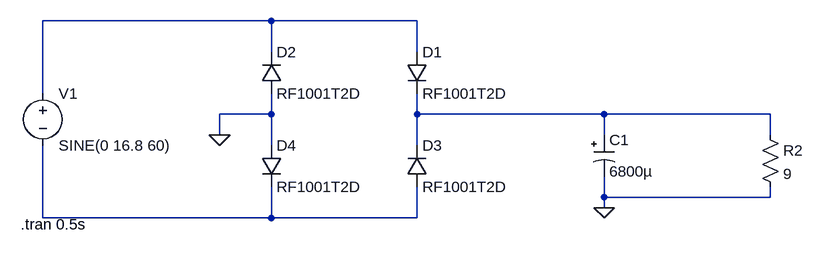
[diagram p0: schematic FulWaveBridge.asc]
FulWaveBridge.asc, the LTspice schematic file:
Version 4
SHEET 1 1120 680
WIRE 256 -128 -96 -128
WIRE 480 -128 256 -128
WIRE 256 -80 256 -128
WIRE 480 -80 480 -128
WIRE -96 -16 -96 -128
WIRE 256 16 256 -16
WIRE 256 16 176 16
WIRE 480 16 480 -16
WIRE 768 16 480 16
WIRE 1024 16 768 16
WIRE 176 48 176 16
WIRE 768 48 768 16
WIRE 1024 48 1024 16
WIRE 256 64 256 16
WIRE 480 64 480 16
WIRE 768 144 768 112
WIRE 1024 144 768 144
WIRE 1024 144 1024 128
WIRE 768 160 768 144
WIRE -96 176 -96 64
WIRE 256 176 256 128
WIRE 256 176 -96 176
WIRE 480 176 480 128
WIRE 480 176 256 176
FLAG 176 48 0
FLAG 768 160 0
SYMBOL voltage -96 -32 R0
WINDOW 123 0 0 Left 0
WINDOW 39 0 0 Left 0
SYMATTR InstName V1
SYMATTR Value SINE(0 16.8 60)
SYMBOL diode 240 64 R0
SYMATTR InstName D4
SYMATTR Value RF1001T2D
SYMBOL diode 464 -80 R0
SYMATTR InstName D1
SYMATTR Value RF1001T2D
SYMBOL diode 240 -16 M180
WINDOW 0 24 64 Left 2
WINDOW 3 24 0 Left 2
SYMATTR InstName D2
SYMATTR Value RF1001T2D
SYMBOL diode 464 128 M180
WINDOW 0 24 64 Left 2
WINDOW 3 24 0 Left 2
SYMATTR InstName D3
SYMATTR Value RF1001T2D
SYMBOL polcap 752 48 R0
WINDOW 3 24 56 Left 2
SYMATTR InstName C1
SYMATTR Value 6800µ
SYMATTR Description Capacitor
SYMATTR Type cap
SYMATTR SpiceLine V=6.3 Irms=2.2 Rser=0.025 Lser=0 mfg="Panasonic" pn="ECA0JFQ682S" type="Al electrolytic"
SYMBOL res 1008 32 R0
SYMATTR InstName R2
SYMATTR Value 9
TEXT -130 186 Left 2 !.tran 0.5s

The netlist it stands for:
* FulWaveBridge.asc
V1 N001 N003 SINE(0 16.8 60)
D4 0 N003 RF1001T2D
D1 N001 N002 RF1001T2D
D2 0 N001 RF1001T2D
D3 N003 N002 RF1001T2D
C1 N002 0 6800µ V=6.3 Irms=2.2 Rser=0.025 Lser=0 mfg="Panasonic" pn="ECA0JFQ682S" type="Al electrolytic"
R2 N002 0 9
.model D D
.lib standard.dio
.tran 0.5s
.backanno
.end